# EAGLE schematic robo0 (EAGLE 9.1.1)
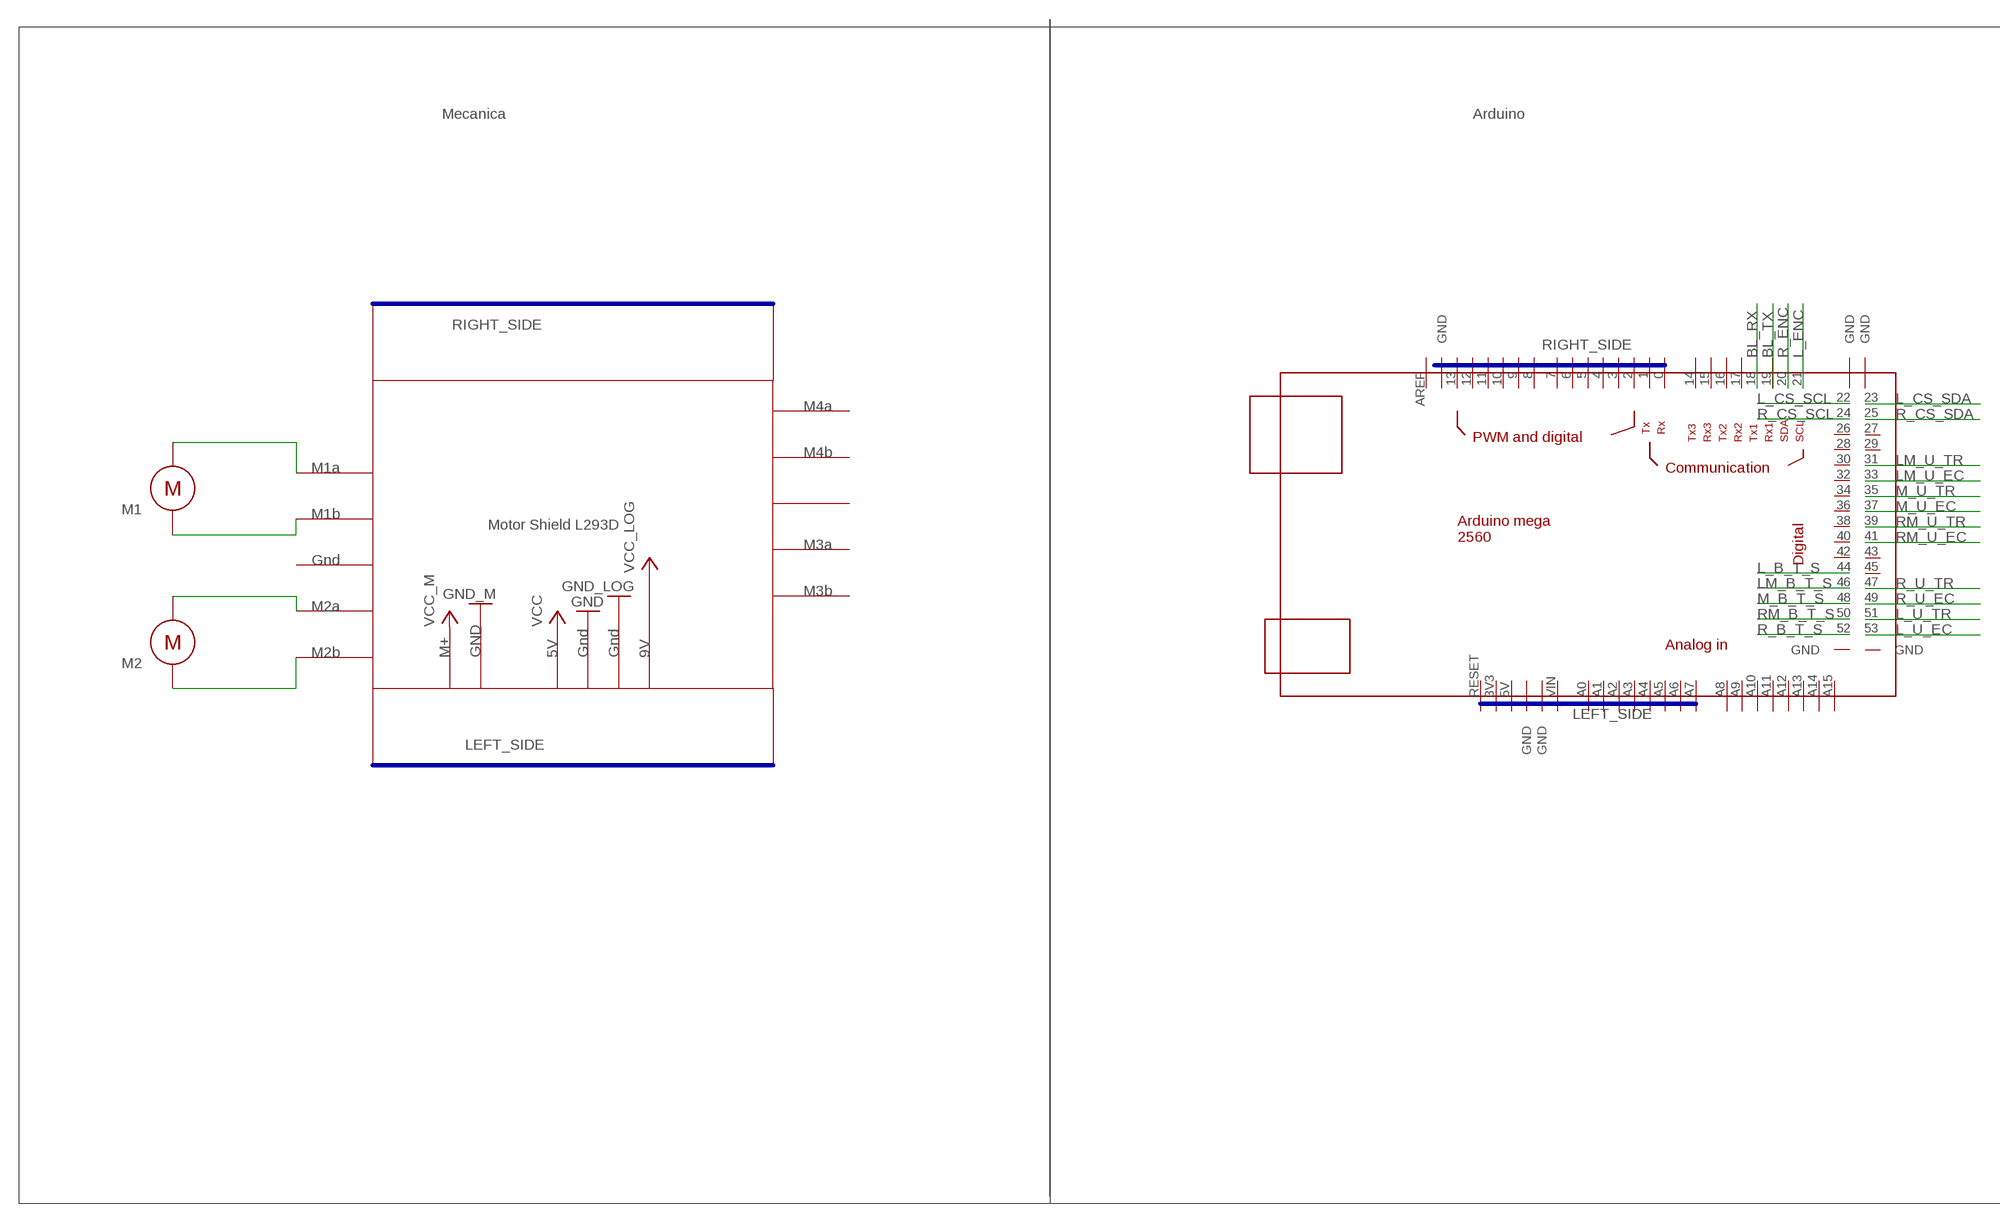
[diagram p0: schematic, sheet 1, part 1 of 2]
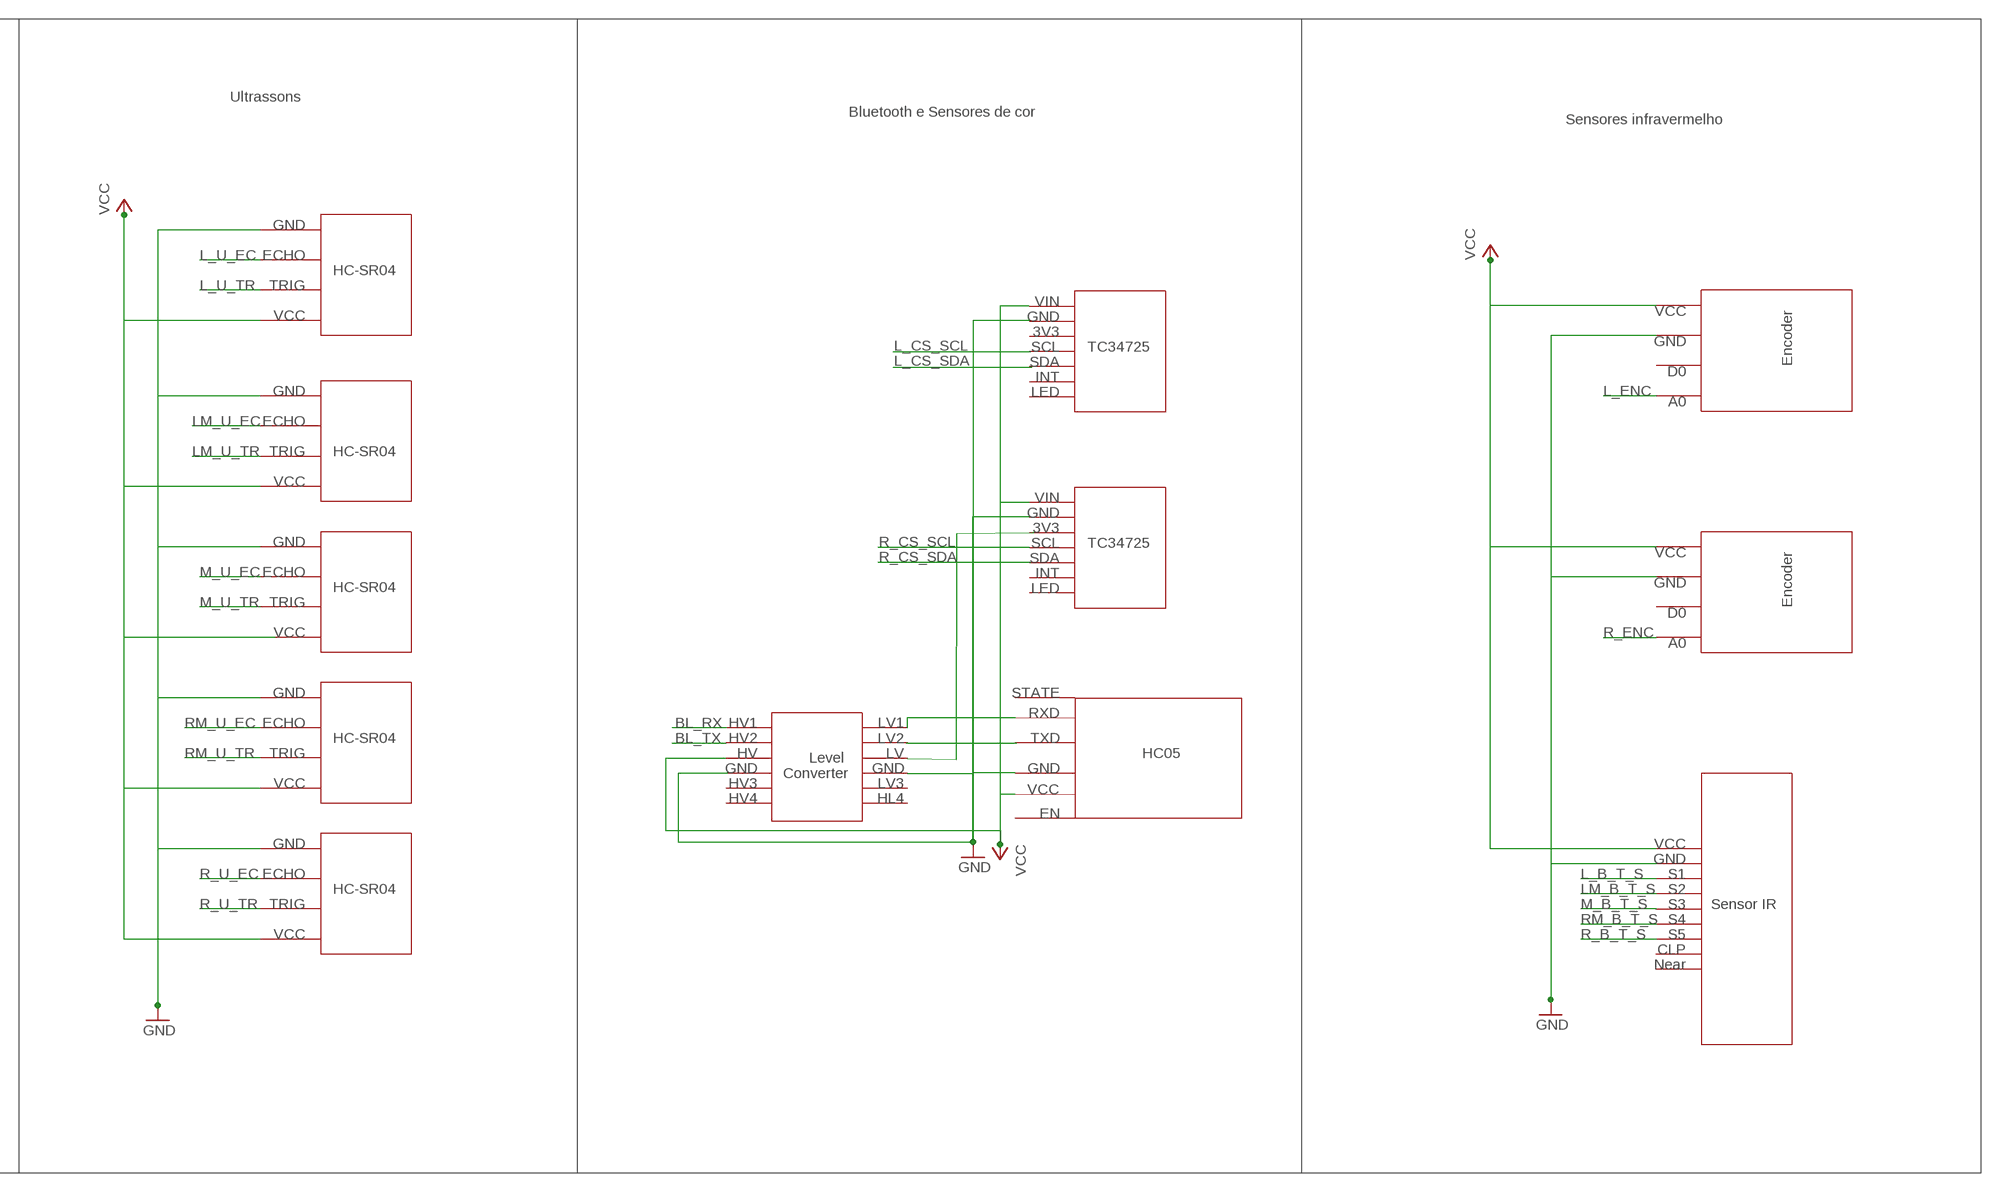
[diagram p1: schematic, sheet 1, part 2 of 2]

## Parts
M1  308-100  [308-100]
M2  308-100  [308-100]
U$1  MEGA_DEVICE  [MEGAOUTLINE]

## Nets
BL_RX: U$1.18
BL_TX: U$1.19
L_B_T_S: U$1.44
L_CS_SCL: U$1.22
L_CS_SDA: U$1.23
L_ENC: U$1.21
L_U_EC: U$1.53
L_U_TR: U$1.51
LM_B_T_S: U$1.46
LM_U_EC: U$1.33
LM_U_TR: U$1.31
M_B_T_S: U$1.48
M_U_EC: U$1.37
M_U_TR: U$1.35
N$1: M1.NEG
N$2: M1.POS
N$3: M2.NEG
N$4: M2.POS
R_B_T_S: U$1.52
R_CS_SCL: U$1.24
R_CS_SDA: U$1.25
R_ENC: U$1.20
R_U_EC: U$1.49
R_U_TR: U$1.47
RM_B_T_S: U$1.50
RM_U_EC: U$1.41
RM_U_TR: U$1.39
Unconnected: U$1.0 U$1.1 U$1.2 U$1.3 U$1.3V3 U$1.4 U$1.5 U$1.5V U$1.6 U$1.7 U$1.8 U$1.9 U$1.10 U$1.11 U$1.12 U$1.13 U$1.14 U$1.15 U$1.16 U$1.17 U$1.26 U$1.27 U$1.28 U$1.29 U$1.30 U$1.32 U$1.34 U$1.36 U$1.38 U$1.40 U$1.42 U$1.43 U$1.45 U$1.A0 U$1.A1 U$1.A2 U$1.A3 U$1.A4 U$1.A5 U$1.A6 U$1.A7 U$1.A8 U$1.A9 U$1.A10 U$1.A11 U$1.A12 U$1.A13 U$1.A14 U$1.A15 U$1.AREF U$1.GND@1(GND) U$1.GND@2(GND) U$1.GND@3(GND) U$1.GND@4(GND) U$1.GND@5(GND) U$1.GND@6(GND) U$1.GND@7(GND) U$1.RESET U$1.VIN

## Buses
LEFT_SIDE
RIGHT_SIDE

## Notes on the sheet
- Ultrassons
- Mecanica | Arduino
- Bluetooth e Sensores de cor
- Sensores infravermelho
- GND
- ECHO
- HC-SR04
- TRIG
- VIN | VCC
- VCC | GND
- 3V3 | GND
- SCL | TC34725
- SDA | D0 | Encoder
- INT
- M4a | GND | LED | A0
- ECHO
- M4b
- M1a | TRIG | HC-SR04
- VCC
- M1b | Motor Shield L293D | VIN
- GND
- M3a | 3V3
- Gnd | GND | SCL | TC34725 | VCC
- SDA
- M3b | ECHO | INT | GND
- M2a | HC-SR04 | LED
- TRIG | D0 | Encoder
- M2b | M+ | GND | 5V | Gnd | Gnd | 9V | VCC | A0
- GND | STATE
- RXD
- ECHO | HV1 | LV1
- HC-SR04 | HV2 | LV2 | TXD
- TRIG | HV | LV | HC05
- GND | GND | GND
- Level 
  Converter
- VCC | HV3 | LV3
- VCC
- HV4 | HL4
- EN
- GND | VCC
- GND
- ECHO | S1
- HC-SR04 | S2
- TRIG | S3 | Sensor IR
- S4
- VCC | S5
- CLP
- Near

## Library data of the parts
M1 M2 = motor:308-100: Pico Vibe 8mm Vibration Motor - 3mm Type; PRECISION_MICRODRIVES: 308-100
U$1 = ArduinoMegaOutline:MEGA_DEVICE: mega card as device